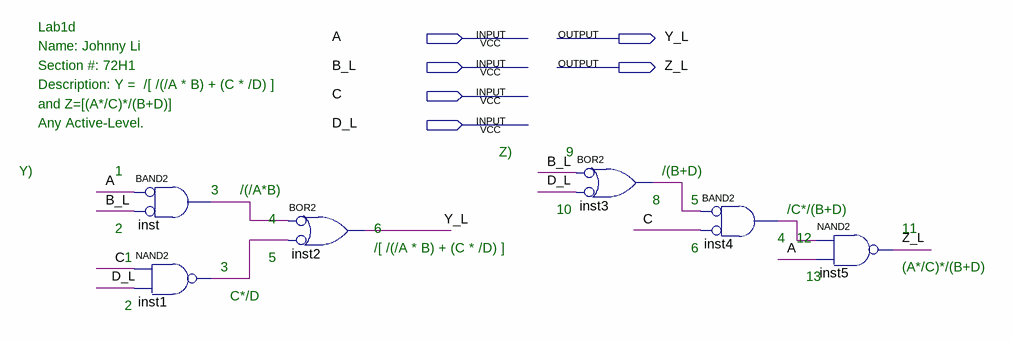
[diagram p0: schematic sheet]
// Quartus schematic lab1d.bdf as structural Verilog: 6 symbols, 6 pins
module lab1d (
  input  A,
  input  B_L,
  input  C,
  input  D_L,
  output Y_L,
  output Z_L
);

  wire inst1_out, inst3_out, inst4_out, inst_out;

  and inst (inst_out, ~A, ~B_L);  // BAND2
  nand inst1 (inst1_out, C, D_L);
  or inst2 (Y_L, ~inst_out, ~inst1_out);  // BOR2
  or inst3 (inst3_out, ~B_L, ~D_L);  // BOR2
  and inst4 (inst4_out, ~inst3_out, ~C);  // BAND2
  nand inst5 (Z_L, inst4_out, A);

  // Notes on the sheet:
  //   Lab1d
  //   Name: Johnny Li
  //   Section #: 72H1
  //   Description: Y =  /[ /(/A * B) + (C * /D) ]
  //   and Z=[(A*/C)*/(B+D)]
  //   Any Active-Level.
  //   Z)
  //   9
  //   Y)
  //   1
  //   /(B+D)
  //   3
  //   /(/A*B)
  //   8
  //   5
  //   10
  //   /C*/(B+D)
  //   4
  //   2
  //   6
  //   11
  //   4
  //   12
  //   /[ /(/A * B) + (C * /D) ]
  //   6
  //   1
  //   5
  //   3
  //   (A*/C)*/(B+D)
  //   13
  //   C*/D
  //   2
endmodule
